# Altium project Calculator.PrjPcb
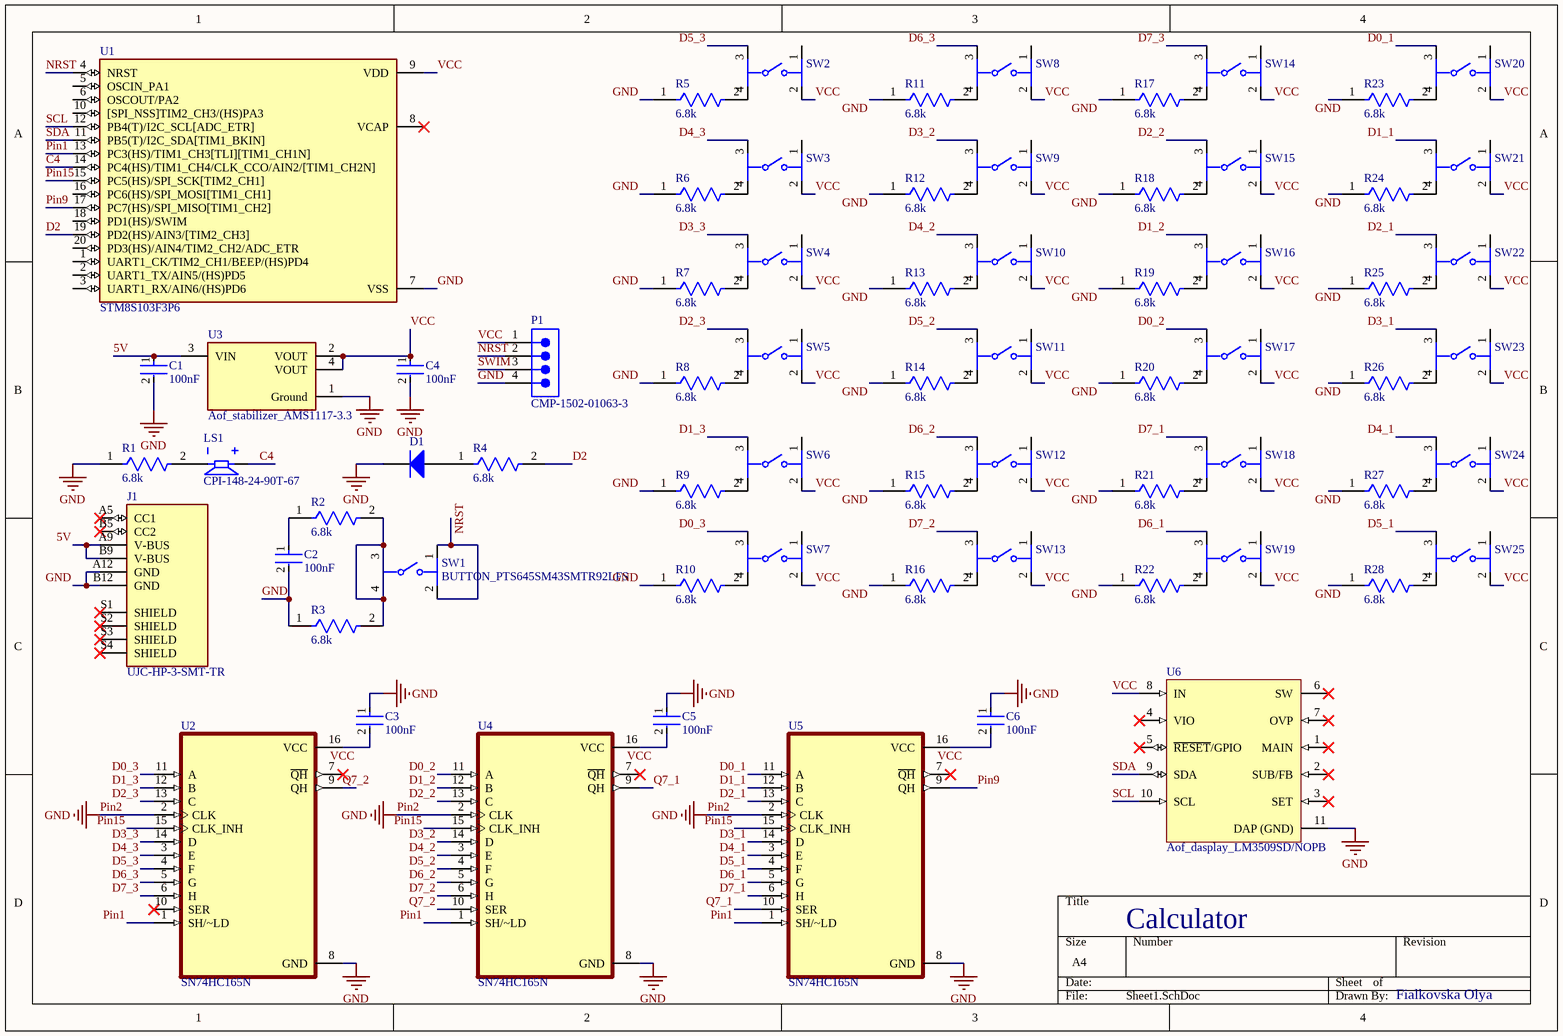
[diagram p0: Sheet1.SchDoc]
1 sheet, 69 parts. Net scope: global (net labels, ports and power ports of the same name join across sheets).

## Sheet Sheet1.SchDoc
size A4; SheetNumber: 1; SheetTotal: 1

### Parts
C1  value 100nF  [FP-GRM033-0_03-MFG]  (hidden comment: Aof_GRM033R61A104KE15D)
C2  value 100nF  [FP-GRM033-0_03-MFG]  (hidden comment: Aof_GRM033R61A104KE15D)
C3  value 100nF  [FP-GRM033-0_03-MFG]  (hidden comment: Aof_GRM033R61A104KE15D)
C4  value 100nF  [FP-GRM033-0_03-MFG]  (hidden comment: Aof_GRM033R61A104KE15D)
C5  value 100nF  [FP-GRM033-0_03-MFG]  (hidden comment: Aof_GRM033R61A104KE15D)
C6  value 100nF  [FP-GRM033-0_03-MFG]  (hidden comment: Aof_GRM033R61A104KE15D)
D1  Diode  (value not drawn)
J1  UJC-HP-3-SMT-TR  [CUI_UJC-HP-3-SMT-TR]
LS1  CPI-148-24-90T-67  [XDCR_CPI-148-24-90T-67]
P1  CMP-1502-01063-3  [61300411021]
R1  value 6.8k  [FP-RK73HW3A-IPC_A]  (hidden comment: Aof_RK73HW3ATTE6801F)
R2  value 6.8k  [FP-RK73HW3A-IPC_A]  (hidden comment: Aof_RK73HW3ATTE6801F)
R3  value 6.8k  [FP-RK73HW3A-IPC_A]  (hidden comment: Aof_RK73HW3ATTE6801F)
R4  value 6.8k  [FP-RK73HW3A-IPC_A]  (hidden comment: Aof_RK73HW3ATTE6801F)
R5  value 6.8k  [FP-RK73HW3A-IPC_A]  (hidden comment: Aof_RK73HW3ATTE6801F)
R6  value 6.8k  [FP-RK73HW3A-IPC_A]  (hidden comment: Aof_RK73HW3ATTE6801F)
R7  value 6.8k  [FP-RK73HW3A-IPC_A]  (hidden comment: Aof_RK73HW3ATTE6801F)
R8  value 6.8k  [FP-RK73HW3A-IPC_A]  (hidden comment: Aof_RK73HW3ATTE6801F)
R9  value 6.8k  [FP-RK73HW3A-IPC_A]  (hidden comment: Aof_RK73HW3ATTE6801F)
R10  value 6.8k  [FP-RK73HW3A-IPC_A]  (hidden comment: Aof_RK73HW3ATTE6801F)
R11  value 6.8k  [FP-RK73HW3A-IPC_A]  (hidden comment: Aof_RK73HW3ATTE6801F)
R12  value 6.8k  [FP-RK73HW3A-IPC_A]  (hidden comment: Aof_RK73HW3ATTE6801F)
R13  value 6.8k  [FP-RK73HW3A-IPC_A]  (hidden comment: Aof_RK73HW3ATTE6801F)
R14  value 6.8k  [FP-RK73HW3A-IPC_A]  (hidden comment: Aof_RK73HW3ATTE6801F)
R15  value 6.8k  [FP-RK73HW3A-IPC_A]  (hidden comment: Aof_RK73HW3ATTE6801F)
R16  value 6.8k  [FP-RK73HW3A-IPC_A]  (hidden comment: Aof_RK73HW3ATTE6801F)
R17  value 6.8k  [FP-RK73HW3A-IPC_A]  (hidden comment: Aof_RK73HW3ATTE6801F)
R18  value 6.8k  [FP-RK73HW3A-IPC_A]  (hidden comment: Aof_RK73HW3ATTE6801F)
R19  value 6.8k  [FP-RK73HW3A-IPC_A]  (hidden comment: Aof_RK73HW3ATTE6801F)
R20  value 6.8k  [FP-RK73HW3A-IPC_A]  (hidden comment: Aof_RK73HW3ATTE6801F)
R21  value 6.8k  [FP-RK73HW3A-IPC_A]  (hidden comment: Aof_RK73HW3ATTE6801F)
R22  value 6.8k  [FP-RK73HW3A-IPC_A]  (hidden comment: Aof_RK73HW3ATTE6801F)
R23  value 6.8k  [FP-RK73HW3A-IPC_A]  (hidden comment: Aof_RK73HW3ATTE6801F)
R24  value 6.8k  [FP-RK73HW3A-IPC_A]  (hidden comment: Aof_RK73HW3ATTE6801F)
R25  value 6.8k  [FP-RK73HW3A-IPC_A]  (hidden comment: Aof_RK73HW3ATTE6801F)
R26  value 6.8k  [FP-RK73HW3A-IPC_A]  (hidden comment: Aof_RK73HW3ATTE6801F)
R27  value 6.8k  [FP-RK73HW3A-IPC_A]  (hidden comment: Aof_RK73HW3ATTE6801F)
R28  value 6.8k  [FP-RK73HW3A-IPC_A]  (hidden comment: Aof_RK73HW3ATTE6801F)
SW1  BUTTON_PTS645SM43SMTR92LFS  [FP-PTS645SM43SMTR92LFS-MFG]
SW2  BUTTON_PTS645SM43SMTR92LFS  [FP-PTS645SM43SMTR92LFS-MFG]  (value not drawn)
SW3  BUTTON_PTS645SM43SMTR92LFS  [FP-PTS645SM43SMTR92LFS-MFG]  (value not drawn)
SW4  BUTTON_PTS645SM43SMTR92LFS  [FP-PTS645SM43SMTR92LFS-MFG]  (value not drawn)
SW5  BUTTON_PTS645SM43SMTR92LFS  [FP-PTS645SM43SMTR92LFS-MFG]  (value not drawn)
SW6  BUTTON_PTS645SM43SMTR92LFS  [FP-PTS645SM43SMTR92LFS-MFG]  (value not drawn)
SW7  BUTTON_PTS645SM43SMTR92LFS  [FP-PTS645SM43SMTR92LFS-MFG]  (value not drawn)
SW8  BUTTON_PTS645SM43SMTR92LFS  [FP-PTS645SM43SMTR92LFS-MFG]  (value not drawn)
SW9  BUTTON_PTS645SM43SMTR92LFS  [FP-PTS645SM43SMTR92LFS-MFG]  (value not drawn)
SW10  BUTTON_PTS645SM43SMTR92LFS  [FP-PTS645SM43SMTR92LFS-MFG]  (value not drawn)
SW11  BUTTON_PTS645SM43SMTR92LFS  [FP-PTS645SM43SMTR92LFS-MFG]  (value not drawn)
SW12  BUTTON_PTS645SM43SMTR92LFS  [FP-PTS645SM43SMTR92LFS-MFG]  (value not drawn)
SW13  BUTTON_PTS645SM43SMTR92LFS  [FP-PTS645SM43SMTR92LFS-MFG]  (value not drawn)
SW14  BUTTON_PTS645SM43SMTR92LFS  [FP-PTS645SM43SMTR92LFS-MFG]  (value not drawn)
SW15  BUTTON_PTS645SM43SMTR92LFS  [FP-PTS645SM43SMTR92LFS-MFG]  (value not drawn)
SW16  BUTTON_PTS645SM43SMTR92LFS  [FP-PTS645SM43SMTR92LFS-MFG]  (value not drawn)
SW17  BUTTON_PTS645SM43SMTR92LFS  [FP-PTS645SM43SMTR92LFS-MFG]  (value not drawn)
SW18  BUTTON_PTS645SM43SMTR92LFS  [FP-PTS645SM43SMTR92LFS-MFG]  (value not drawn)
SW19  BUTTON_PTS645SM43SMTR92LFS  [FP-PTS645SM43SMTR92LFS-MFG]  (value not drawn)
SW20  BUTTON_PTS645SM43SMTR92LFS  [FP-PTS645SM43SMTR92LFS-MFG]  (value not drawn)
SW21  BUTTON_PTS645SM43SMTR92LFS  [FP-PTS645SM43SMTR92LFS-MFG]  (value not drawn)
SW22  BUTTON_PTS645SM43SMTR92LFS  [FP-PTS645SM43SMTR92LFS-MFG]  (value not drawn)
SW23  BUTTON_PTS645SM43SMTR92LFS  [FP-PTS645SM43SMTR92LFS-MFG]  (value not drawn)
SW24  BUTTON_PTS645SM43SMTR92LFS  [FP-PTS645SM43SMTR92LFS-MFG]  (value not drawn)
SW25  BUTTON_PTS645SM43SMTR92LFS  [FP-PTS645SM43SMTR92LFS-MFG]  (value not drawn)
U1  STM8S103F3P6  [SOP65P640X120-20N]
U2  SN74HC165N  [DIP794W45P254L1969H508Q16]
U3  Aof_stabilizer_AMS1117-3.3  [FP-AMS1117-IPC_B]
U4  SN74HC165N  [DIP794W45P254L1969H508Q16]
U5  SN74HC165N  [DIP794W45P254L1969H508Q16]
U6  Aof_dasplay_LM3509SD/NOPB  [DSC0010A_V]

### Nets
GND: C1.2 C2.2 C3.1 C4.2 C5.1 C6.1 D1.2(K) J1.A12(GND) J1.B12(GND) P1.4 R1.1 R3.1 R5.1 R6.1 R7.1 R8.1 R9.1 R10.1 R11.1 R12.1 R13.1 R14.1 R15.1 R16.1 R17.1 R18.1 R19.1 R20.1 R21.1 R22.1 R23.1 R24.1 R25.1 R26.1 R27.1 R28.1 U1.7(VSS) U2.2(CLK) U2.8(GND) U3.1(Ground) U4.2(CLK) U4.8(GND) U5.2(CLK) U5.8(GND) U6.11(DAP_(GND))  [also labelled Pin2]
5V: C1.1 J1.A9(V-BUS) J1.B9(V-BUS) U3.3(VIN)
C4: LS1.P U1.14(PC4(HS)/TIM1_CH4/CLK_CCO/AIN2/[TIM1_CH2N])
D0_1: SW20.3 U5.11(A)
D0_2: SW17.3 U4.11(A)
D0_3: SW7.3 U2.11(A)
D1_1: SW21.3 U5.12(B)
D1_2: SW16.3 U4.12(B)
D1_3: SW6.3 U2.12(B)
D2: R4.2 U1.19(PD2(HS)/AIN3/[TIM2_CH3])
D2_1: SW22.3 U5.13(C)
D2_2: SW15.3 U4.13(C)
D2_3: SW5.3 U2.13(C)
D3_1: SW23.3 U5.14(D)
D3_2: SW9.3 U4.14(D)
D3_3: SW4.3 U2.14(D)
D4_1: SW24.3 U5.3(E)
D4_2: SW10.3 U4.3(E)
D4_3: SW3.3 U2.3(E)
D5_1: SW25.3 U5.4(F)
D5_2: SW11.3 U4.4(F)
D5_3: SW2.3 U2.4(F)
D6_1: SW19.3 U5.5(G)
D6_2: SW12.3 U4.5(G)
D6_3: SW8.3 U2.5(G)
D7_1: SW18.3 U5.6(H)
D7_2: SW13.3 U4.6(H)
D7_3: SW14.3 U2.6(H)
NRST: P1.2 SW1.1 SW1.2 U1.4(NRST)
Pin1: U1.13(PC3(HS)/TIM1_CH3[TLI][TIM1_CH1N]) U2.1(SH/~LD) U4.1(SH/~LD) U5.1(SH/~LD)
Pin9: U1.17(PC7(HS)/SPI_MISO[TIM1_CH2]) U5.9(QH)
Pin15: U1.15(PC5(HS)/SPI_SCK[TIM2_CH1]) U2.15(CLK_INH) U4.15(CLK_INH) U5.15(CLK_INH)
Q7_1: U4.9(QH) U5.10(SER)
Q7_2: U2.9(QH) U4.10(SER)
SCL: U1.12(PB4(T)/I2C_SCL[ADC_ETR]) U6.10(SCL)
SDA: U1.11(PB5(T)/I2C_SDA[TIM1_BKIN]) U6.9(SDA)
SWIM: P1.3
VCC: C3.2 C4.1 C5.2 C6.2 P1.1 SW2.2 SW3.2 SW4.2 SW5.2 SW6.2 SW7.2 SW8.2 SW9.2 SW10.2 SW11.2 SW12.2 SW13.2 SW14.2 SW15.2 SW16.2 SW17.2 SW18.2 SW19.2 SW20.2 SW21.2 SW22.2 SW23.2 SW24.2 SW25.2 U1.9(VDD) U2.16(VCC) U3.2(VOUT) U3.4(VOUT) U4.16(VCC) U5.16(VCC) U6.8(IN)
NetC2_1: C2.1 R2.1
NetD1_1: D1.1(A) R4.1
NetLS1_N: LS1.N R1.2
NetR2_2: R2.2 R3.2 SW1.3 SW1.4
NetR5_2: R5.2 SW2.4
NetR6_2: R6.2 SW3.4
NetR7_2: R7.2 SW4.4
NetR8_2: R8.2 SW5.4
NetR9_2: R9.2 SW6.4
NetR10_2: R10.2 SW7.4
NetR11_2: R11.2 SW8.4
NetR12_2: R12.2 SW9.4
NetR13_2: R13.2 SW10.4
NetR14_2: R14.2 SW11.4
NetR15_2: R15.2 SW12.4
NetR16_2: R16.2 SW13.4
NetR17_2: R17.2 SW14.4
NetR18_2: R18.2 SW15.4
NetR19_2: R19.2 SW16.4
NetR20_2: R20.2 SW17.4
NetR21_2: R21.2 SW18.4
NetR22_2: R22.2 SW19.4
NetR23_2: R23.2 SW20.4
NetR24_2: R24.2 SW21.4
NetR25_2: R25.2 SW22.4
NetR26_2: R26.2 SW23.4
NetR27_2: R27.2 SW24.4
NetR28_2: R28.2 SW25.4

Not connected (* = marked no-connect by the designer): J1 A5(CC1)* B5(CC2)* S1(SHIELD)* S2(SHIELD)* S3(SHIELD)* S4(SHIELD)*; SW2 1; SW3 1; SW4 1; SW5 1; SW6 1; SW7 1; SW8 1; SW9 1; SW10 1; SW11 1; SW12 1; SW13 1; SW14 1; SW15 1; SW16 1; SW17 1; SW18 1; SW19 1; SW20 1; SW21 1; SW22 1; SW23 1; SW24 1; SW25 1; U1 1(UART1_CK/TIM2_CH1/BEEP/(HS)PD4) 2(UART1_TX/AIN5/(HS)PD5) 3(UART1_RX/AIN6/(HS)PD6) 5(OSCIN_PA1) 6(OSCOUT/PA2) 8(VCAP)* 10([SPI_NSS]TIM2_CH3/(HS)PA3) 16(PC6(HS)/SPI_MOSI[TIM1_CH1]) 18(PD1(HS)/SWIM) 20(PD3(HS)/AIN4/TIM2_CH2/ADC_ETR); U2 7(~{QH})* 10(SER)*; U4 7(~{QH})*; U5 7(~{QH})*; U6 1(MAIN)* 2(SUB/FB)* 3(SET)* 4(VIO)* 5(~{RESET}/GPIO)* 6(SW)* 7(OVP)*

### Notes on the sheet
- Calculator
- Fialkovska Olya

### Library data of the parts
C1-C6 = CMP-001-00224-1: 10V 100nF X5R ±10% 0201 Multilayer Ceramic Capacitors MLCC - SMD/SMT ROHS; Min Operating Temperature: -55°C; Mounting Technology: Surface Mount; Case/Package: 0201; Max Operating Temperature: 85°C; Tolerance: 10%; Voltage Rating: 10V
D1 = Diode: AF: 1; BV: 0; BV_MAX: 1e99; EG: 1.11; FC: 0.5; IBV: 0.001; ISR: 1e-14; MJSW: 0.33; NTUN: 30; TNOM: 27; XTI: 3; SimulationGenericComponent: True; CJO: 0; CJP: 0; CTA: 0; CTP: 0; FCS: 0.5; FV_MAX: 1e99; IKF: 0; IKR: 0; JSW: 0; JTUN: 0; JTUNSW: 0; KEG: 1; KF: 0; LEVEL: 1; N: 1; NBV: 1; NR: 1; NS: 1; PHP: 1; RS: 0; TCV: 0; TLEV: 0; TLEVC: 0; TM1: 0; TM2: 0; TPB: 0; TPHP: 0; TRS: 0; TRS2: 0; TT: 0; TTT1: 0; TTT2: 0; VJ: 1; XTITUN: 3; IS: 1e-14
J1 = CMP-039-000002-1: Source: UJC-HP-3-SMT-TR.SchLib; Package: None; Pin Count: 10; Design Item ID: UJC-HP-3-SMT-TR; Price: None; Component Type: Standard; Value: *; Availability: Unavailable; MP: UJC-HP-3-SMT-TR
LS1 = CMP-037-000003-1: 13,9 РјРј, 24 Р’ РїРѕСЃС‚. С‚РѕРєР°, 90 РґР‘, СЃРєРІРѕР·РЅРѕРµ РѕС‚РІРµСЂСЃС‚РёРµ, РїСЊРµР·РѕСЌР»РµРєС‚СЂРёС‡РµСЃРєРёР№ Р·РІСѓРєРѕРІРѕР№ РёРЅРґРёРєР°С‚РѕСЂ; MF: Same Sky; Design Item ID: CPI-148-24-90T-67; Source: CPI-148-24-90T-67.SchLib; SnapEDA_Link: https://www.snapeda.com/parts/CPI-148-24-90T-67/Same+Sky/view-part/?ref=snap; Check_prices: https://www.snapeda.com/parts/CPI-148-24-90T-67/Same+Sky/view-part/?ref=eda; Value: *; MP: CPI-148-24-90T-67; Component Type: Standard; Pin Count: 2; Package: None
P1 = CMP-043-000002-1: NexarPartId: 31153320; Contact Resistance: 20m?; Pitch: 2.54mm; Operating Supply Voltage: 250V; Current Rating: 3A; Number of Positions: 4; Gender: Male; Connector Type: Male Pin; Source: Components - 25.08.25 - 11.48.SchLib; Mount: Through Hole; Design Item ID: CMP-1502-01063-3; Contact Plating: Gold; Number of Pins: 4; Termination: Solder; Lead Pitch: 2.54mm; Color: Black; Pin Count: 4; Component Type: Standard; Contact Mating Length: 5.9944mm; Contact Material: Copper; REACH SVHC: Unknown; RoHS: Compliant; Number of Rows: 1; Number of Contacts: 4
R1-R28 = CMP-009-00422-1: Fixed Resistor, Metal Glaze/thick Film, 1W, 6800ohm, 200V, 1% +/-Tol, 100ppm/Cel, Surface Mount, 2512; Tolerance: 1%; Voltage Rating: 200V; Min Operating Temperature: -55°C; Max Operating Temperature: 155°C; Case/Package: 2512; Mounting Technology: Surface Mount
SW1-SW25 = CMP-00012-1: Keypad Switch, 1 Switches, SPST, Momentary-tactile, 0.05A, 12VDC, 1.57N, 4 PCB Hole Cnt, Solder Terminal, Surface Mount-straight; Body Breadth: 5.9944mm; Dielectric Withstand Volts: 250VACV; Contact Resistance: 0.1mR; Contact Voltage(DC)-Max: 12V; Insulation Resistance: 100GR; Contact Current(DC)-Max: 50mA; Actuator Type: Pushbutton; Contact DC Max Rating R Load: 0.05A@12VDC; Body Height: 3.4544mm; PCB Hole Count: 4; Switch Type: Keypad; Termination: Solder; Switch Action: MOMENTARY; Min Operating Temperature: -20°C; Mounting Technology: Surface Mount; Max Operating Temperature: 60°C; Terminal Finish: Silver; Terminal Length: 0.138inch; Reach SVHC Compliant: Yes; Switch Function: SPST; RoHS Compliant: Yes; Body Length or Diameter: 5.9944mm; JESD-609 Code: e4
U1 = CMP-031-00017-1: STM8 series Microcontroller IC 8-Bit 16MHz 8KB (8K x 8) FLASH 20-TSSOP; MF: STMicroelectronics; Check_prices: https://www.snapeda.com/parts/STM8S103F3P6/STMicroelectronics/view-part/?ref=eda; MP: STM8S103F3P6; Source: STM8S103F3P6.SchLib; Design Item ID: STM8S103F3P6; Value: *; Pins: 20; Component Type: Standard; SnapEDA_Link: https://www.snapeda.com/parts/STM8S103F3P6/STMicroelectronics/view-part/?ref=snap; Case/Package: TSSOP-20 STMicroelectronics
U2 U4 U5 = CMP-031-000001-1: 8-Bit Parallel-Load Shift Registers; MF: Texas Instruments; SnapEDA_Link: https://www.snapeda.com/parts/SN74HC165N/Texas+Instruments/view-part/?ref=snap; Check_prices: https://www.snapeda.com/parts/SN74HC165N/Texas+Instruments/view-part/?ref=eda; Package: PDIP-16 Texas Instruments; Pin Count: 16; Design Item ID: SN74HC165N; Value: *; MP: SN74HC165N; Component Type: Standard; Source: SN74HC165N.SchLib
U3 = CMP-00028-00008-1: Gull Wing EAR99 Fixed Positive Single Output Ldo Regulator Dual Voltage Regulator Linear 125C 1.2W 1A 1.8MM; Pins: 2; Case/Package: SOT-223; Max Operating Temperature: 125°C; Min Operating Temperature: -40°C
U6 = CMP-007-00044-1: Tape & Reel (TR) LM3509 Step-Up (Boost) I2C led driver 3mm 440muA 5.5V 1.25MHz; Min Operating Temperature: -40°C; Pins: 10; Mounting Technology: Surface Mount; Max Operating Temperature: 85°C